# EAGLE design SensorBoard (EAGLE 9.4.1)
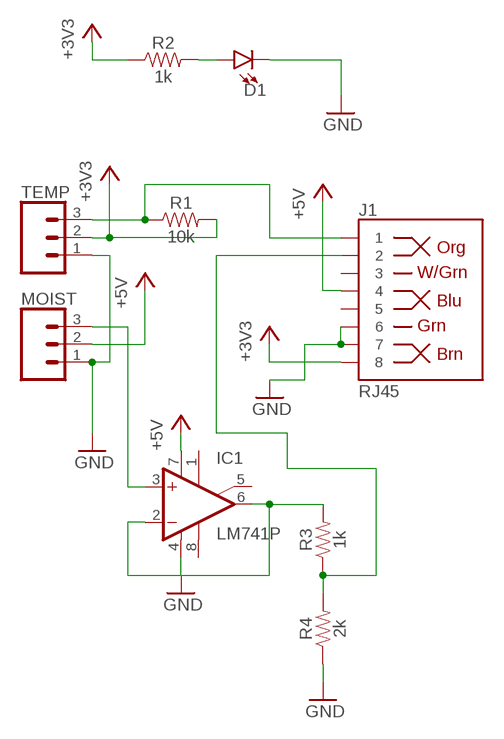
[diagram p0: schematic, sheet 1]

## Parts
D1  LED3MM  [LED_3MM]
IC1  LM741P  [DIL08]
J1  RJ45  RJ45-8  [RJ45-8]
MOIST  CONN_03  [1X03]
R1  10k  1KOHM-HORIZ-1/4W-1%  [AXIAL-0.3]
R2  1k  1KOHM-HORIZ-1/4W-1%  [AXIAL-0.3]
R3  1k  1KOHM-HORIZ-1/4W-1%  [AXIAL-0.3]
R4  2k  1KOHM-HORIZ-1/4W-1%  [AXIAL-0.3]
TEMP  CONN_03  [1X03]

## Nets
+3V3: J1.8 R1.P$2 R2.P$1 TEMP.2
+5V: IC1.7(V+) J1.4 MOIST.2
GND: D1.K(C) IC1.4(V-) J1.6 J1.7 MOIST.1 R4.P$1 TEMP.1
N$2: IC1.2(-IN) IC1.6(OUT) R3.P$2
N$3: D1.A R2.P$2
N$4: J1.1 R1.P$1 TEMP.3
N$5: IC1.3(+IN) MOIST.3
N$6: J1.2 R3.P$1 R4.P$2
Unconnected: IC1.1(ON1) IC1.5(ON2) IC1.8(OPT) J1.3 J1.5

## Library data of the parts
D1 = SparkFun-LED:LED: LED (Generic) Standard schematic elements and footprints for 5mm, 3mm, 1206, and 0603 sized LEDs. Generic LEDs with no color specified.; PROD_ID: DIO-08794
IC1 = linear:*741: OP AMP
J1 = SparkFun-Connectors:RJ45-8: RJ45 Jack - 8 pin Simple RJ45, 8-pin connection. Commonly used for Cat5, Cat5e, and Cat6 Ethernet cables. Here is the connector we sell at SparkFun: RJ45 8-Pin Connector <https://www.sparkfun.com/products/643> (PRT-00643) Datasheet <https://cdn.sparkfun.com/datasheets/Prototyping/04908.pdf> It is used on this SparkFun product: SparkFun RJ45 Breakout <https://www.sparkfun.com/products/716> (BOB-00716) Note, you may also be interested in the "MAGJACK" version of this. It is basically a RJ45 connector, but also has some status LEDs built into the connector housing. You can check that out in this library at the device named "MAGJACK.dev" and see these products online: RJ45 Ethernet MagJack-Compatible <https://www.sparkfun.com/products/8534> (PRT-08534) SparkFun RJ45 MagJack Breakout <https://www.sparkfun.com/products/13021> (BOB-13021); PROD_ID: CONN-08506; SF_ID: PRT-00643
MOIST TEMP = SparkFun-Connectors:CONN_03: Multi connection point. Often used as Generic Header-pin footprint for 0.1 inch spaced/style header connections On any of the 0.1 inch spaced packages, you can populate with these: Break Away Headers - Straight <https://www.sparkfun.com/products/116> (PRT-00116) Break Away Male Headers - Right Angle <https://www.sparkfun.com/products/553> (PRT-00553) Female Headers <https://www.sparkfun.com/products/115> (PRT-00115) Break Away Headers - Machine Pin <https://www.sparkfun.com/products/117> (PRT-00117) Break Away Female Headers - Swiss Machine Pin <https://www.sparkfun.com/products/743> (PRT-00743) Stackable Header - 3 Pin (Female, 0.1") <https://www.sparkfun.com/products/13875> (PRT-13875) For SCREWTERMINALS and SPRING TERMINALS visit here: Screw Terimnals on SparkFun.com <https://www.sparkfun.com/search/results?term=Screw+Terminals> (5mm/3.5mm/2.54mm spacing) This device is also useful as a general connection point to wire up your design to another part of your project. Our various solder wires solder well into these plated through hole pads. Hook-Up Wire - Assortment (Stranded, 22 AWG) <https://www.sparkfun.com/products/11375> (PRT-11375) Hook-Up Wire - Assortment (Solid Core, 22 AWG) <https://www.sparkfun.com/products/11367> (PRT-11367) View the entire wire category on our website here <https://www.sparkfun.com/categories/141> Special notes: Molex polarized connector foot print use with SKU : PRT-08232 with associated crimp pins and housings.
R1 R4 = SparkFun-Resistors:1KOHM: 1kΩ resistor A resistor is a passive two-terminal electrical component that implements electrical resistance as a circuit element. Resistors act to reduce current flow, and, at the same time, act to lower voltage levels within circuits. - Wikipedia; PROD_ID: RES-12182; VALUE: 1k
R2 R3 = SparkFun-Resistors:1KOHM: 1kΩ resistor A resistor is a passive two-terminal electrical component that implements electrical resistance as a circuit element. Resistors act to reduce current flow, and, at the same time, act to lower voltage levels within circuits. - Wikipedia; PROD_ID: RES-12182

## Board
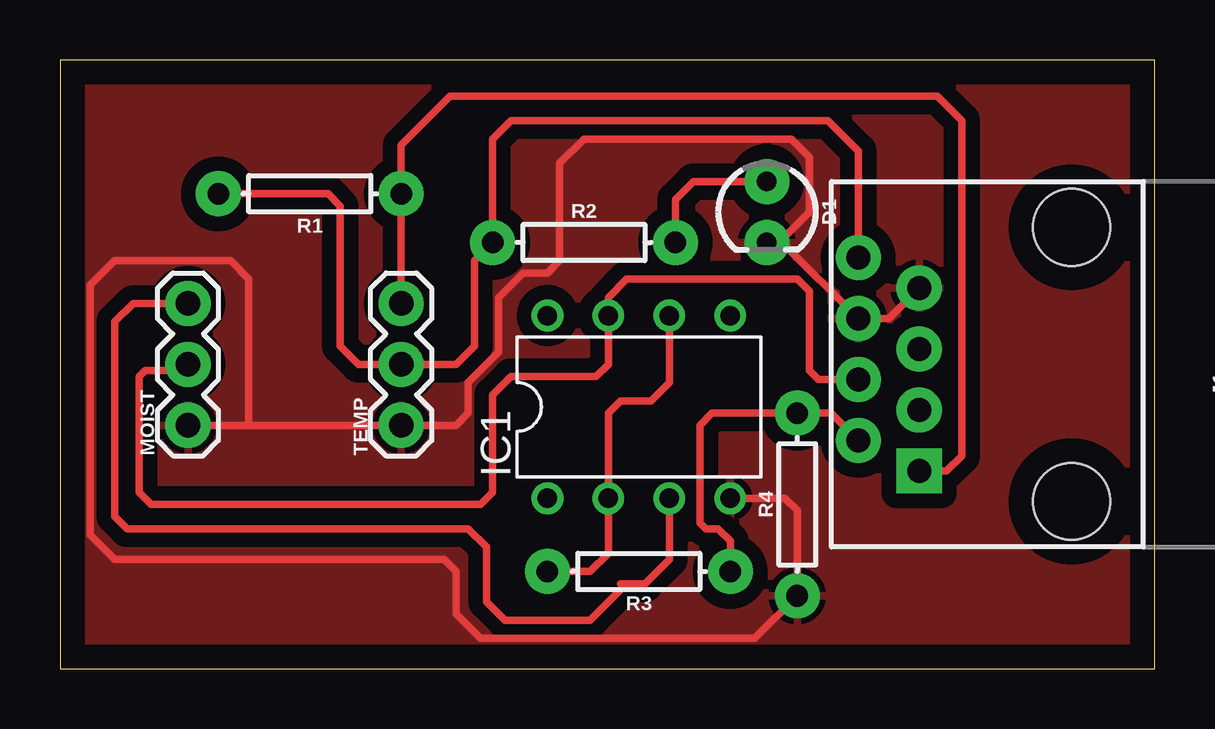
[diagram p1: board, top side]
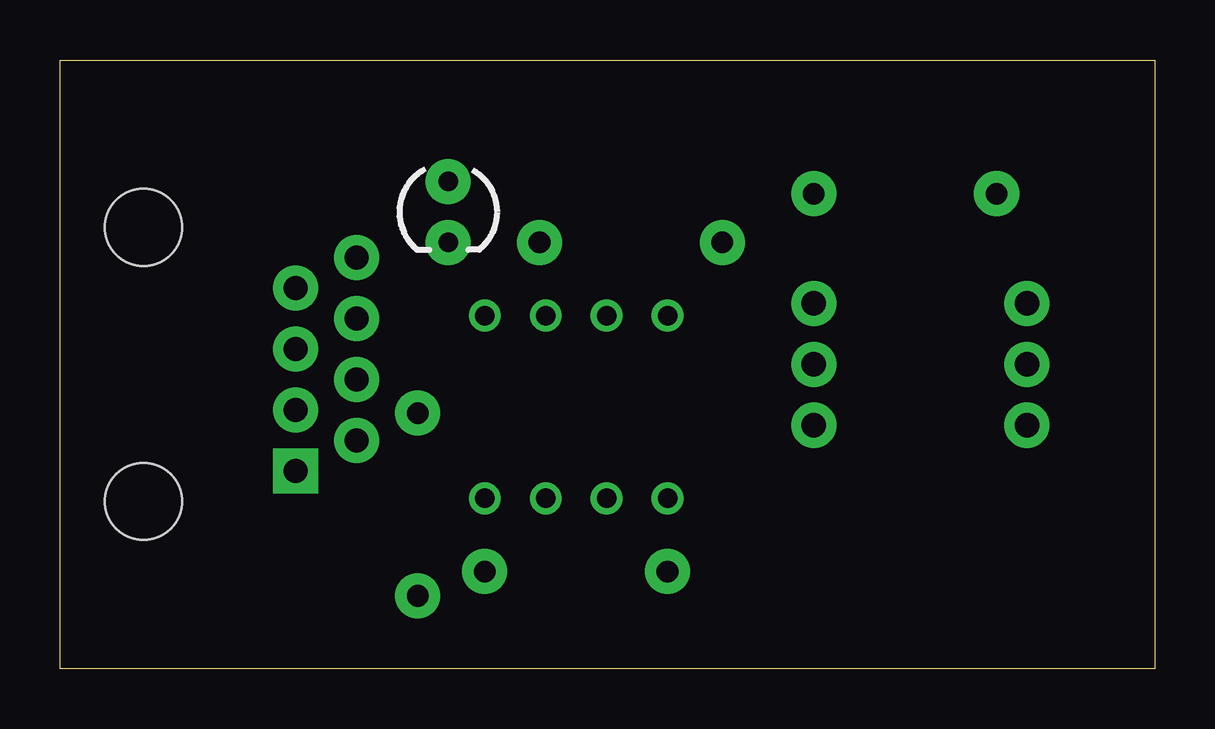
[diagram p2: board, bottom side, seen from below]

Size 45.64 x 25.39 mm. Coordinates in mm from the lower left corner, seen from the top.
Outline: 0,0 45.64,0 45.64,25.39 0,25.39 0,0
Copper layers (1*16): Top 0.035mm / dielectric 1.5mm / Bottom 0.035mm
Design rules "default": minimum track width 6mil, minimum drill 0.35mm, track to track 6mil, track to pad 6mil, pad to pad 6mil, via to via 6mil, smd to smd 6mil, copper to edge 40mil, drill to drill 6mil, minimum pad ring 10mil, minimum via ring 8mil, stop-mask expansion 4mil, vias tented up to drill 0mil, thermal gap 10mil

### Footprints (pad centres in the part's own frame; a part is rotated, then mirrored left to right if it is on the bottom)
LED_3MM = drill 0.813 pad 1.88: A -1.27,0; K 1.27,0
DIL08 = drill 0.813 pad 1.27: 1 -3.81,-3.81; 2 -1.27,-3.81; 3 1.27,-3.81; 4 3.81,-3.81; 5 3.81,3.81; 6 1.27,3.81; 7 -1.27,3.81; 8 -3.81,3.81
RJ45-8 = drill 1 pad 1.88 square: 1 -4.445,6.35 | drill 1 pad 1.88: 2 -3.175,8.89; 3 -1.905,6.35; 4 -0.635,8.89; 5 0.635,6.35; 6 1.905,8.89; 7 3.175,6.35; 8 4.445,8.89 | hole 3.2: -5.715,0; 5.715,0
1X03 = drill 1.016 pad 1.88: 1 0,0; 2 2.54,0; 3 5.08,0
AXIAL-0.3 = drill 0.9 pad 1.88: P$1 -3.81,0; P$2 3.81,0

### Placement (x,y rotation side)
D1  29.46,19.05 270 top
IC1  24.13,10.92 0 top
J1  42.16,12.7 90 top
MOIST  5.33,10.16 90 top
R1  10.41,19.81 180 top
R2  21.84,17.78 0 top
R3  24.13,4.06 180 top
R4  30.73,6.86 90 top
TEMP  14.22,10.16 90 top

### Tracks (layer width: path | path; a pad name or v marks a point on that pad's centre or on a via)
+3V3
  Top 0.305: J1.8 33.27,21.59 32,22.86 18.8,22.86 18.03,22.1 R2.P$1 17.27,17.02 17.27,13.46 16.51,12.7 TEMP.2 12.45,12.7 11.68,13.46 11.68,19.3 11.18,19.81 R1.P$2
+5V
  Top 0.305: J1.4 31.62,12.06 31.24,12.45 31.24,15.75 30.73,16.26 23.62,16.26 22.86,15.49 IC1.7 22.86,12.7 22.35,12.19 18.8,12.19 18.03,11.43 18.03,7.37 17.53,6.86 3.81,6.86 3.3,7.37 3.3,12.19 3.56,12.45 5.08,12.45 MOIST.2
GND
  Top 0.305: MOIST.1 7.87,10.16 | 7.87,10.16 TEMP.1 16.51,10.16 17.02,10.67 17.02,11.94 18.29,13.21 18.29,15.49 19.3,16.51 20.32,16.51 20.83,17.02 20.83,21.08 21.84,22.1 30.48,22.1 31.24,21.34 31.24,19.05 29.97,17.78 D1.K 30.1,17.78 J1.6 34.54,14.6 J1.7 | IC1.4 30.23,7.11 30.73,6.6 R4.P$1 28.96,1.27 17.53,1.27 16.51,2.29 16.51,4.06 16,4.57 2.29,4.57 1.27,5.59 1.27,16 2.29,17.02 7.11,17.02 7.87,16.26 7.87,10.16
  pour Top (isolate 0.61): 0,25.4 45.72,25.4 45.72,0 0,0
N$2
  Top 0.305: IC1.6 25.4,11.94 24.64,11.18 23.37,11.18 22.86,10.67 IC1.2 22.86,4.83 22.1,4.06 R3.P$2
N$3
  Top 0.305: R2.P$2 25.65,19.56 26.42,20.32 D1.A
N$4
  Top 0.305: TEMP.3 R1.P$1 14.22,21.84 16.26,23.88 36.58,23.88 37.59,22.86 37.59,8.89 36.96,8.26 J1.1
N$5
  Top 0.305: IC1.3 25.4,4.57 24.38,3.56 23.62,3.56 | 23.62,3.56 23.37,3.56 | 23.62,3.56 22.1,2.03 18.54,2.03 17.78,2.79 17.78,5.08 17.02,5.84 2.79,5.84 2.29,6.35 2.29,14.48 3.05,15.24 MOIST.3
N$6
  Top 0.305: J1.2 32.13,10.67 30.99,10.67 R4.P$2 27.18,10.67 26.67,10.16 26.67,6.1 26.92,5.84 27.43,5.84 27.94,5.33 R3.P$1